# Altium schematic sheet efr32_lcd_hmi.SchDoc
size Letter; SheetNumber: 2; SheetTotal: 8
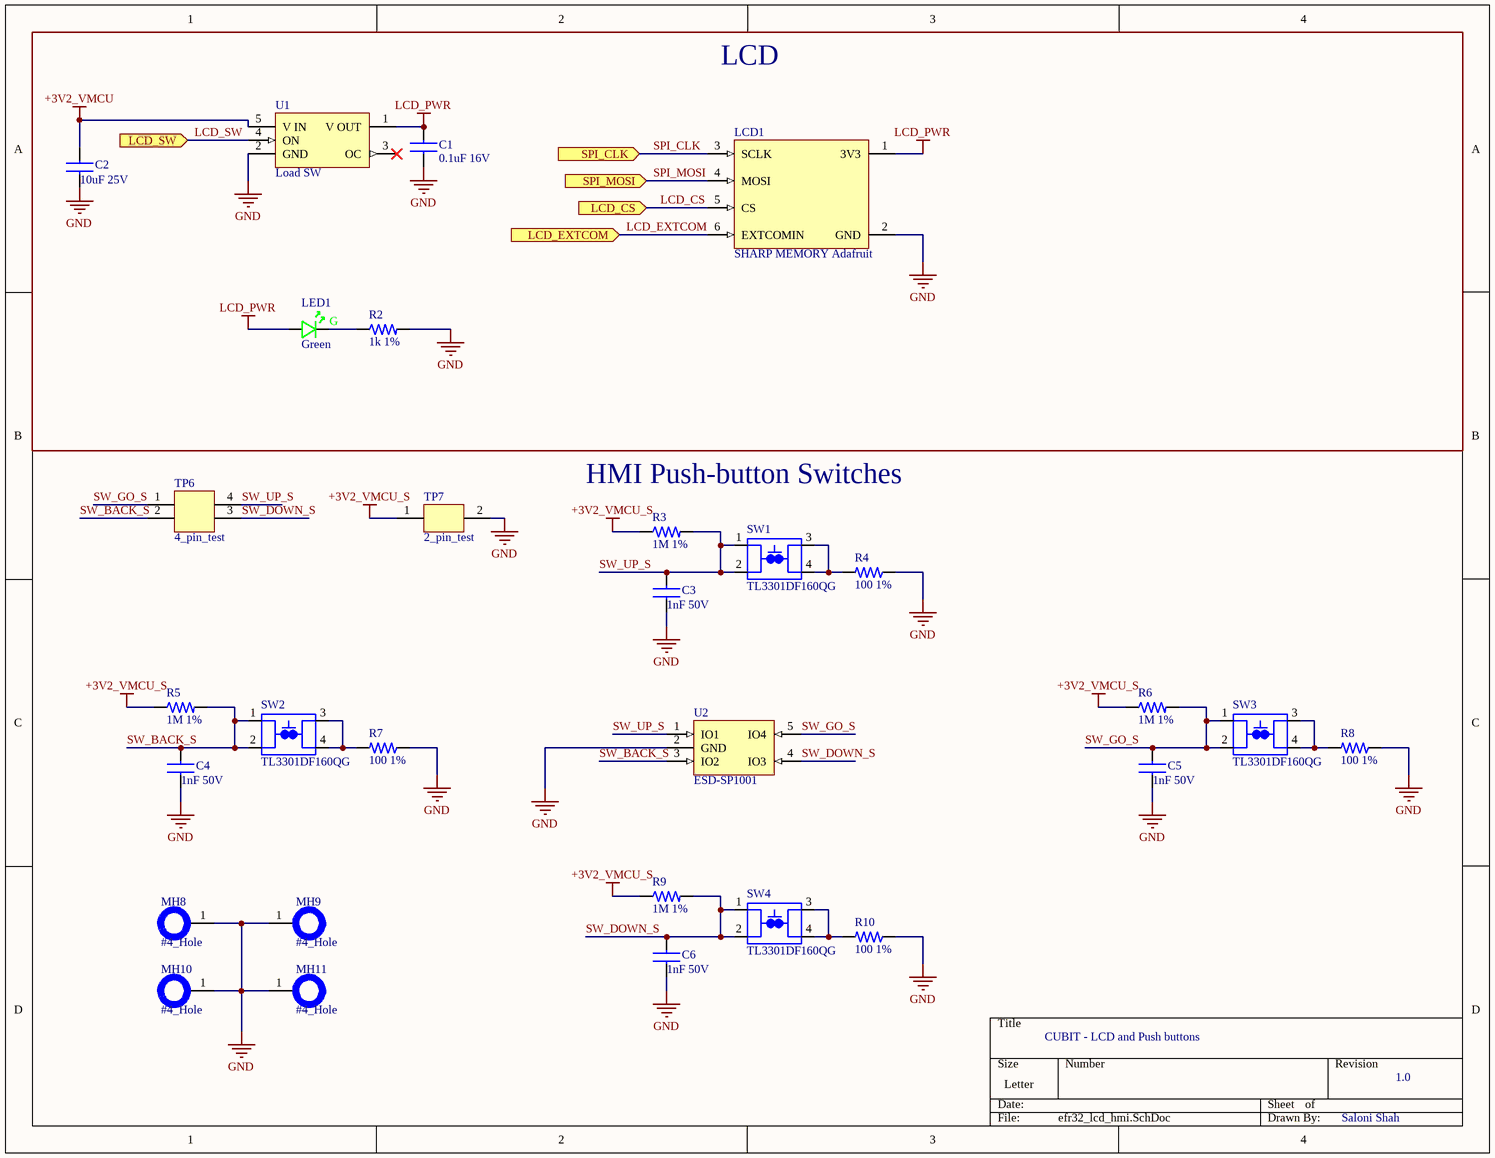
[diagram p0: efr32_lcd_hmi.SchDoc]

## Parts
C1  0.1uF 16V  [CAP_0603_1MM]
C2  10uF 25V  [CAP_0805_02X125]
C3  1nF 50V  [CAP_0805_02X125]
C4  1nF 50V  [CAP_0805_02X125]
C5  1nF 50V  [CAP_0805_02X125]
C6  1nF 50V  [CAP_0805_02X125]
LCD1  SHARP MEMORY Adafruit  [6_PIN_100MIL]
LED1  Green  [LED_0603_RED_WL-SMCW]
MH8  #4_Hole  [HOLE_#4]
MH9  #4_Hole  [HOLE_#4]
MH10  #4_Hole  [HOLE_#4]
MH11  #4_Hole  [HOLE_#4]
R2  1k 1%  [2_Chip_0603_RMCF]
R3  1M 1%  [2_Chip_0603_RMCF]
R4  100 1%  [2_Chip_0603_RMCF]
R5  1M 1%  [2_Chip_0603_RMCF]
R6  1M 1%  [2_Chip_0603_RMCF]
R7  100 1%  [2_Chip_0603_RMCF]
R8  100 1%  [2_Chip_0603_RMCF]
R9  1M 1%  [2_Chip_0603_RMCF]
R10  100 1%  [2_Chip_0603_RMCF]
SW1  TL3301DF160QG  [SW_TL3301DF160QG]
SW2  TL3301DF160QG  [SW_TL3301DF160QG]
SW3  TL3301DF160QG  [SW_TL3301DF160QG]
SW4  TL3301DF160QG  [SW_TL3301DF160QG]
TP6  4_pin_test  [4_PIN_100MIL]
TP7  2_pin_test  [2_PIN_100mil]
U1  Load SW  [SOT65P210X110-5N]
U2  ESD-SP1001  [SOT65P210X110-5N]

## Blocks framed on the sheet
LCD: C1 C2 LCD1 LED1 R2 U1

## Ports
LCD_CS (in), LCD_EXTCOM (in), LCD_SW (in), SPI_CLK (in), SPI_MOSI (in)

## Nets
+3V2_VMCU: C2.1 U1.5(V_IN)
+3V2_VMCU_S: R3.1 R5.1 R6.1 R9.1 TP7.1
GND: C1.2 C2.2 C3.2 C4.2 C5.2 C6.2 LCD1.2(GND) MH8.1 MH9.1 MH10.1 MH11.1 R2.2 R4.1 R7.1 R8.1 R10.1 TP7.2 U1.2(GND) U2.2(GND)
LCD_PWR: C1.1 LCD1.1(3V3) LED1.A U1.1(V_OUT)
LCD_CS: LCD1.5(CS) ; port LCD_CS
LCD_EXTCOM: LCD1.6(EXTCOMIN) ; port LCD_EXTCOM
LCD_SW: U1.4(ON) ; port LCD_SW
SPI_CLK: LCD1.3(SCLK) ; port SPI_CLK
SPI_MOSI: LCD1.4(MOSI) ; port SPI_MOSI
SW_BACK_S: C4.1 R5.2 SW2.1 SW2.2 TP6.2 U2.3(IO2)
SW_DOWN_S: C6.1 R9.2 SW4.1 SW4.2 TP6.3 U2.4(IO3)
SW_GO_S: C5.1 R6.2 SW3.1 SW3.2 TP6.1 U2.5(IO4)
SW_UP_S: C3.1 R3.2 SW1.1 SW1.2 TP6.4 U2.1(IO1)
NetLED1_C: LED1.C R2.1
NetR4_2: R4.2 SW1.3 SW1.4
NetR7_2: R7.2 SW2.3 SW2.4
NetR8_2: R8.2 SW3.3 SW3.4
NetR10_2: R10.2 SW4.3 SW4.4

Not connected (* = marked no-connect by the designer): U1 3(OC)*

## Notes on the sheet
- HMI Push-button Switches
- CUBIT - LCD and Push buttons
- 1.0
- Saloni Shah
- (in symbol QBLP601-AG1) G

## Library data of the parts
C1 = C0805C104K4RACAUTO: Cap Ceramic 0.1uF 16V X7R 10% SMD 0603 125°C Paper T/R; Manufacturer: KEMET; Capacitance: 100nF; Supplier 1: Digi-Key; Manufacturer Part Number: C0805C104K4RACAUTO; RoHS: Yes; Category: Ceramic Capacitors; Stock 1: 15900; Pricing 1: 1=0.24000, 10=0.16200, 50=0.09700, 100=0.08190, 500=0.05606, 1000=0.04959 (USD); Case/Package: 0805; Min Operating Temperature: -55°C; Max Operating Temperature: 125°C; Tolerance: 10%; Packaging: Tape and Reel; Dielectric: X7R; Length: 2mm; Depth: 1.25mm; RoHS Compliant: Yes; ComponentLink1URL: http://components.arrow.com/part/dataview/0323_00325188?src-supplier=Arrow+Europe; ComponentLink1Description: http://components.arrow.com/part/dataview/0323_00325188?src-supplier=Arrow+Europe
C2 = GRM21BR61E106KA73K: Cap 0805 25 V 10 uF ±20% Tolerance X5R Monolithic Ceramic Chip Capacitor; Manufacturer: Murata; Tolerance: 10%; Supplier 1: Digi-Key; Manufacturer Part Number: GRM21BR61E106KA73K; RoHS: Yes; Category: Ceramic Capacitors; Stock 1: 1875; Pricing 1: 1=0.23000, 10=0.15700, 50=0.09400, 100=0.07940, 500=0.05434, 1000=0.04807, 2500=0.04598, 5000=0.04180 (USD); Mount: Surface Mount; Case/Package: 0805; Weight: 0.000335oz; Min Operating Temperature: -55°C; Max Operating Temperature: 85°C; Packaging: Tape and Reel; Capacitance: 10uF; Voltage Rating: 25V; Package Quantity: 10000; Dielectric: X5R; Voltage Rating (DC): 25V; Length: 0.079inch; Width: 0.049inch; Thickness: 0.055inch; RoHS Compliant: Yes; ComponentLink1URL: http://www.mouser.com/ds/2/281/c02e-2905.pdf?src-supplier=Mouser; ComponentLink1Description: http://www.mouser.com/ds/2/281/c02e-2905.pdf?src-supplier=Mouser; ComponentLink2URL: http://search.murata.co.jp/Ceramy/image/img/A01X/G101/ENG/GRM21BR61E106KA73-01.pdf?src-supplier=Digi-Key; ComponentLink2Description: http://search.murata.co.jp/Ceramy/image/img/A01X/G101/ENG/GRM21BR61E106KA73-01.pdf?src-supplier=Digi-Key; ComponentLink3URL: https://search.murata.co.jp/Ceramy/image/img/A01X/G101/ENG/GRM21BR61E106KA73-01.pdf?src-supplier=Digi-Key; ComponentLink3Description: https://search.murata.co.jp/Ceramy/image/img/A01X/G101/ENG/GRM21BR61E106KA73-01.pdf?src-supplier=Digi-Key
C3-C6 = CL21B102KBANFNC: 1nF ±10% 50V X7R 0805; Manufacturer: Samsung; Supplier 1: Digi-Key; Manufacturer Part Number: CL21B102KBANFNC; RoHS: Yes; Category: Ceramic Capacitors; Stock 1: 1056; Pricing 1: 1=0.10000, 10=0.04300, 50=0.02360, 100=0.01940, 500=0.01382, 1000=0.01086 (USD); Mount: Surface Mount; Case/Package: 0805; Case Code (Metric): 2012; Case Code (Imperial): 0805; Contact Plating: Tin; Min Operating Temperature: -55°C; Max Operating Temperature: 125°C; Capacitance: 1nF; Tolerance: 10%; Package Quantity: 1; Packaging: Tape and Reel; Voltage Rating: 50V; Dielectric: X7R; Series: CL; Construction: Flat; Length: 0.079inch; Width: 0.049inch; Height: 0.65mm; Thickness: 0.03inch; Depth: 1.25mm; Radiation Hardening: No; RoHS Compliant: Yes; ComponentLink1URL: https://datasheet.ciiva.com/25780/cl21b102kbanfnc-25780808.pdf?src-supplier=Digi-Key; ComponentLink1Description: https://datasheet.ciiva.com/25780/cl21b102kbanfnc-25780808.pdf?src-supplier=Digi-Key
LCD1 = 3502: Conn AV RCA (Phono) Plug 2 Cont Sz 0.125" Cbl Mnt Clamp Copper Alloy; Manufacturer: Adafruit Industries; Display Type: LCD; Resolution (height): 168pixel; Resolution (width): 144pixel; Background Color: Grey; Supplier 1: Digi-Key; Manufacturer Part Number: 3502; RoHS: No; Category: Audio / Video Connectors; Stock 1: 10; Pricing 1: 1=24.95000 (USD); ComponentLink1URL: https://cdn-learn.adafruit.com/downloads/pdf/adafruit-sharp-memory-display-breakout.pdf?src-supplier=Digi-Key; ComponentLink1Description: https://cdn-learn.adafruit.com/downloads/pdf/adafruit-sharp-memory-display-breakout.pdf?src-supplier=Digi-Key
LED1 = QBLP601-AG1: Led Green Clear 0603 SMD; Manufacturer: QT-Brightek; Supplier 1: Digi-Key; Manufacturer Part Number: QBLP601-AG1; RoHS: No; Stock 1: 5990; Pricing 1: 1=0.35000, 10=0.19000, 100=0.08820, 500=0.08140, 1000=0.06377, 2000=0.06242 (USD)
MH8-MH11 = Mechanical_Hole
R2 = RMCF0603FT1K00: Res 1K Ohm 1% 0.1W(1/10W) ±100ppm/C Pad SMD Automotive T/R; Manufacturer: Stackpole Electronics; Resistance: 1kR; Power Rating: 100mW; Temperature Coefficient: 100ppm/°C; Supplier 1: Digi-Key; Manufacturer Part Number: RMCF0603FT1K00; RoHS: Yes; Category: Chip SMD Resistors; Pricing 1: 1=0.10000, 10=0.01700, 100=0.00680, 1000=0.00305, 2500=0.00264 (USD); Mount: Surface Mount; Case/Package: 0603; Case Code (Metric): 1608; Case Code (Imperial): 0603; Contact Plating: Tin,Matte; Size Code: 0603; Min Operating Temperature: -55°C; Max Operating Temperature: 155°C; Tolerance: 1%; Packaging: Tape and Reel; Resistor Type: Thick Film; Number of Terminations: 2; Max Power Dissipation: 100mW; Features: Automotive AEC-Q200; Series: RMCF; Construction: Rectangular; Length: 1.55mm; Width: 0.031inch; Height: 0.022inch; Depth: 0.8mm; Radiation Hardening: No; Military Standard: Not; Lead Free: Lead Free; RoHS Compliant: Yes; ComponentLink1URL: https://www.seielect.com/catalog/sei-rmcf_rmcp.pdf?src-supplier=Digi-Key; ComponentLink1Description: https://www.seielect.com/catalog/sei-rmcf_rmcp.pdf?src-supplier=Digi-Key; ComponentLink2URL: https://www.seielect.com/catalog/SEI-RMCF_RMCP.pdf?src-supplier=Avnet; ComponentLink2Description: https://www.seielect.com/catalog/SEI-RMCF_RMCP.pdf?src-supplier=Avnet; ComponentLink3URL: https://www.seielect.com/catalog/SEI-Packaging.pdf?src-supplier=Avnet; ComponentLink3Description: https://www.seielect.com/catalog/SEI-Packaging.pdf?src-supplier=Avnet; ComponentLink4URL: https://www.seielect.com/catalog/SEI-Packaging.pdf?src-supplier=Arrow+Electronics; ComponentLink4Description: https://www.seielect.com/catalog/SEI-Packaging.pdf?src-supplier=Arrow+Electronics; ComponentLink5URL: https://www.seielect.com/catalog/SEI-RMCF_RMCP.pdf?src-supplier=Avnet+Asia; ComponentLink5Description: https://www.seielect.com/catalog/SEI-RMCF_RMCP.pdf?src-supplier=Avnet+Asia; ComponentLink6URL: http://www.seielect.com/Catalog/SEI-rmc.pdf?src-supplier=Future+Electronics; ComponentLink6Description: http://www.seielect.com/Catalog/SEI-rmc.pdf?src-supplier=Future+Electronics; ComponentLink7URL: https://www.seielect.com/catalog/SEI-Packaging.pdf?src-supplier=Verical; ComponentLink7Description: https://www.seielect.com/catalog/SEI-Packaging.pdf?src-supplier=Verical; ComponentLink8URL: https://www.seielect.com/catalog/SEI-Packaging.pdf?src-supplier=Quest; ComponentLink8Description: https://www.seielect.com/catalog/SEI-Packaging.pdf?src-supplier=Quest
R3 R5 R6 R9 = RMCF0603FT1M00: Res 1M Ohm 1% 1/10W ±100ppm/°C Molded SMD Paper T/R; Manufacturer: Stackpole Electronics; Resistance: 1MR; Power Rating: 100mW; Working Voltage: 75V; Supplier 1: Digi-Key; Manufacturer Part Number: RMCF0603FT1M00; RoHS: Yes; Category: Chip SMD Resistors; Stock 1: 2136203; Pricing 1: 1=0.10000, 10=0.01700, 100=0.00680, 1000=0.00305, 2500=0.00264 (USD); Mount: Surface Mount; Case/Package: 0603; Case Code (Metric): 1608; Case Code (Imperial): 0603; Contact Plating: Tin,Matte; Min Operating Temperature: -55°C; Max Operating Temperature: 155°C; Tolerance: 1%; Packaging: Tape and Reel; Resistor Type: Thick Film; Number of Terminations: 2; Max Power Dissipation: 100mW; Temperature Coefficient: 100ppm/°C; Features: Automotive AEC-Q200; Series: RMCF; Construction: Rectangular; Technology: THICK FILM; Length: 1.55mm; Width: 0.031inch; Height: 0.022inch; Depth: 0.8mm; Radiation Hardening: No; Military Standard: Not; Lead Free: Lead Free; RoHS Compliant: Yes; ComponentLink1URL: https://datasheet.ciiva.com/15193/getdatasheetpartid-363151-15193451.pdf?src-supplier=Verical; ComponentLink1Description: https://datasheet.ciiva.com/15193/getdatasheetpartid-363151-15193451.pdf?src-supplier=Verical
R4 R7 R8 R10 = RMCF0603FT100R: Res 100 Ohm 1% 1/10W ±100ppm/°C Molded SMD SMD Paper T/R; Manufacturer: Stackpole Electronics; Resistance: 100R; Power Rating: 100mW; Supplier 1: Digi-Key; Manufacturer Part Number: RMCF0603FT100R; RoHS: Yes; Category: Chip SMD Resistors; Pricing 1: 1=0.10000, 10=0.01700, 100=0.00680, 1000=0.00305, 2500=0.00264 (USD); Mount: Surface Mount; Case/Package: 0603; Case Code (Metric): 1608; Case Code (Imperial): 0603; Contact Plating: Tin,Matte; Size Code: 0603; Min Operating Temperature: -55°C; Max Operating Temperature: 155°C; Tolerance: 1%; Packaging: Tape and Reel; Resistor Type: Thick Film; Number of Terminations: 2; Max Power Dissipation: 100mW; Temperature Coefficient: 100ppm/°C; Features: Automotive AEC-Q200; Series: RMCF; Construction: Rectangular; Length: 1.55mm; Width: 0.031inch; Height: 0.022inch; Depth: 0.8mm; Radiation Hardening: No; Military Standard: Not; Lead Free: Lead Free; RoHS Compliant: Yes; ComponentLink1URL: https://datasheet.ciiva.com/15215/getdatasheetpartid-360413-15215981.pdf?src-supplier=Verical; ComponentLink1Description: https://datasheet.ciiva.com/15215/getdatasheetpartid-360413-15215981.pdf?src-supplier=Verical
SW1-SW4 = TL3301DF160QG: Tactile Switch SPST-NO Top Actuated Surface Mount; MF: E-Switch; Price: None; Availability: Unavailable; Package: None; MP: TL3301DF160QG; Value: *; SnapEDA_Link: https://www.snapeda.com/parts/TL3301DF160QG/E-Switch/view-part/169822/?ref=snap
U1 = TPS22942DCKR: 5.5-V, 0.1-A, 500-mΩ, load switch with current limit and active low enable 5-SC70 -40 to 85; Manufacturer: Texas Instruments; Number of Outputs: 1; Output Current: 200mA; Nominal Supply Current: 1uA; Max Output Current: 100mA; Max Supply Voltage: 5.5V; Min Supply Voltage: 1.62V; Interface: On/Off; On-State Resistance: 500mR; Turn-On Delay Time: 60us; Turn-Off Delay Time: 30us; Max Supply Current: 80uA; Max Power Dissipation: 1.22mW; Quiescent Current: 40uA; Fault Protection: Over Temperature; Output Configuration: High Side; Supplier 1: Digi-Key; Manufacturer Part Number: TPS22942DCKR; RoHS: Yes; Category: Hot Swap Controllers; Stock 1: 1111; Pricing 1: 1=1.24000, 10=1.10700, 25=1.05080, 100=0.86310, 250=0.80676, 500=0.71296, 1000=0.61950 (USD); Case/Package: SC; Number of Pins: 5; Weight: 8.8E-05oz; Min Operating Temperature: -40°C; Max Operating Temperature: 85°C; Packaging: Tape and Reel; Number of Inputs: 1; Package Quantity: 3000; Max Input Voltage: 5.5V; Min Input Voltage: 1.62V; Termination: SMD/SMT; Min Current Limit: 100mA; Number of Channels: 1; Radiation Hardening: No; REACH SVHC: No SVHC; Lead Free: Lead Free; RoHS Compliant: Yes; ComponentLink1URL: https://datasheet.ciiva.com/1962/tps22945-1962436.pdf?src-supplier=Digi-Key; ComponentLink1Description: https://datasheet.ciiva.com/1962/tps22945-1962436.pdf?src-supplier=Digi-Key; ComponentLink2URL: https://datasheet.ciiva.com/15103/getdatasheetpartid-122296-15103873.pdf?src-supplier=Verical; ComponentLink2Description: https://datasheet.ciiva.com/15103/getdatasheetpartid-122296-15103873.pdf?src-supplier=Verical; ComponentLink3URL: https://datasheet.ciiva.com/1512/1840307-1512708.pdf?src-supplier=Element14; ComponentLink3Description: https://datasheet.ciiva.com/1512/1840307-1512708.pdf?src-supplier=Element14; ComponentLink4URL: https://datasheet.ciiva.com/1963/tps22942-1963503.pdf?src-supplier=Digi-Key; ComponentLink4Description: https://datasheet.ciiva.com/1963/tps22942-1963503.pdf?src-supplier=Digi-Key; ComponentLink5URL: https://datasheet.ciiva.com/1963/tps22942-1963502.pdf?src-supplier=Digi-Key; ComponentLink5Description: https://datasheet.ciiva.com/1963/tps22942-1963502.pdf?src-supplier=Digi-Key; ComponentLink6URL: https://datasheet.ciiva.com/3233/tps22945-3233582.pdf?src-supplier=Avnet; ComponentLink6Description: https://datasheet.ciiva.com/3233/tps22945-3233582.pdf?src-supplier=Avnet; ComponentLink7URL: https://datasheet.ciiva.com/26074/tps22945-26074375.pdf?src-supplier=Avnet+Europe; ComponentLink7Description: https://datasheet.ciiva.com/26074/tps22945-26074375.pdf?src-supplier=Avnet+Europe
U2 = SP1001-04JTG: TVS DIODE 5.5VWM 13VC SC70-5; Manufacturer: Littelfuse; Direction: Unidirectional; Capacitance: 8pF; Operating Supply Voltage: 5.5V; Max Surge Current: 2A; Number of Channels: 4; Clamping Voltage: 9.7V; Min Breakdown Voltage: 7V; Power Line Protection: No; Leakage Current: 500nA; Diode Type: ZENER; Clamping Voltage-Max: 13V; Supplier 1: Digi-Key; Manufacturer Part Number: SP1001-04JTG; RoHS: Yes; Category: TVS Diodes; Stock 1: 62579; Pricing 1: 1=0.61000, 10=0.52000, 100=0.38810, 500=0.30492, 1000=0.23562 (USD); Mount: Surface Mount; Case/Package: SC; Number of Pins: 5; Min Operating Temperature: -40°C; Max Operating Temperature: 85°C; Packaging: Tape and Reel; Package Quantity: 3000; Polarity: Unidirectional; Breakdown Voltage: 5.5V; Termination: SMD/SMT; Number of Unidirectional Channels: 4; Reverse Standoff Voltage: 5.5V; Working Voltage: 5.5V; Peak Pulse Current: 2A; Resistor Type: Zener; Series: Automotive, AEC-Q101, SP1001, SPA®; Length: 2.25mm; Depth: 1.35mm; Radiation Hardening: No; REACH SVHC: Unknown; Lead Free: Lead Free; RoHS Compliant: Yes; ComponentLink1URL: https://datasheet.ciiva.com/4510/littelfuse-spa-sp1001-0x-63620-4510770.pdf?src-supplier=Mouser; ComponentLink1Description: https://datasheet.ciiva.com/4510/littelfuse-spa-sp1001-0x-63620-4510770.pdf?src-supplier=Mouser; ComponentLink2URL: https://datasheet.ciiva.com/1268/littelfuse-spa-sp1001-0x-1268334.pdf?src-supplier=Element14; ComponentLink2Description: https://datasheet.ciiva.com/1268/littelfuse-spa-sp1001-0x-1268334.pdf?src-supplier=Element14; ComponentLink3URL: https://datasheet.ciiva.com/331/littelfuse-tvs-diode-array-sp1001-datasheet-pdf-331765.pdf?src-supplier=Digi-Key; ComponentLink3Description: https://datasheet.ciiva.com/331/littelfuse-tvs-diode-array-sp1001-datasheet-pdf-331765.pdf?src-supplier=Digi-Key; ComponentLink4URL: https://datasheet.ciiva.com/331/littelfuse-tvs-diode-array-sp1001-datasheet-pdf-331766.pdf?src-supplier=Digi-Key; ComponentLink4Description: https://datasheet.ciiva.com/331/littelfuse-tvs-diode-array-sp1001-datasheet-pdf-331766.pdf?src-supplier=Digi-Key; ComponentLink5URL: https://datasheet.ciiva.com/331/littelfuse-tvs-diode-array-sp1001-datasheet-pdf-331764.pdf?src-supplier=Digi-Key; ComponentLink5Description: https://datasheet.ciiva.com/331/littelfuse-tvs-diode-array-sp1001-datasheet-pdf-331764.pdf?src-supplier=Digi-Key